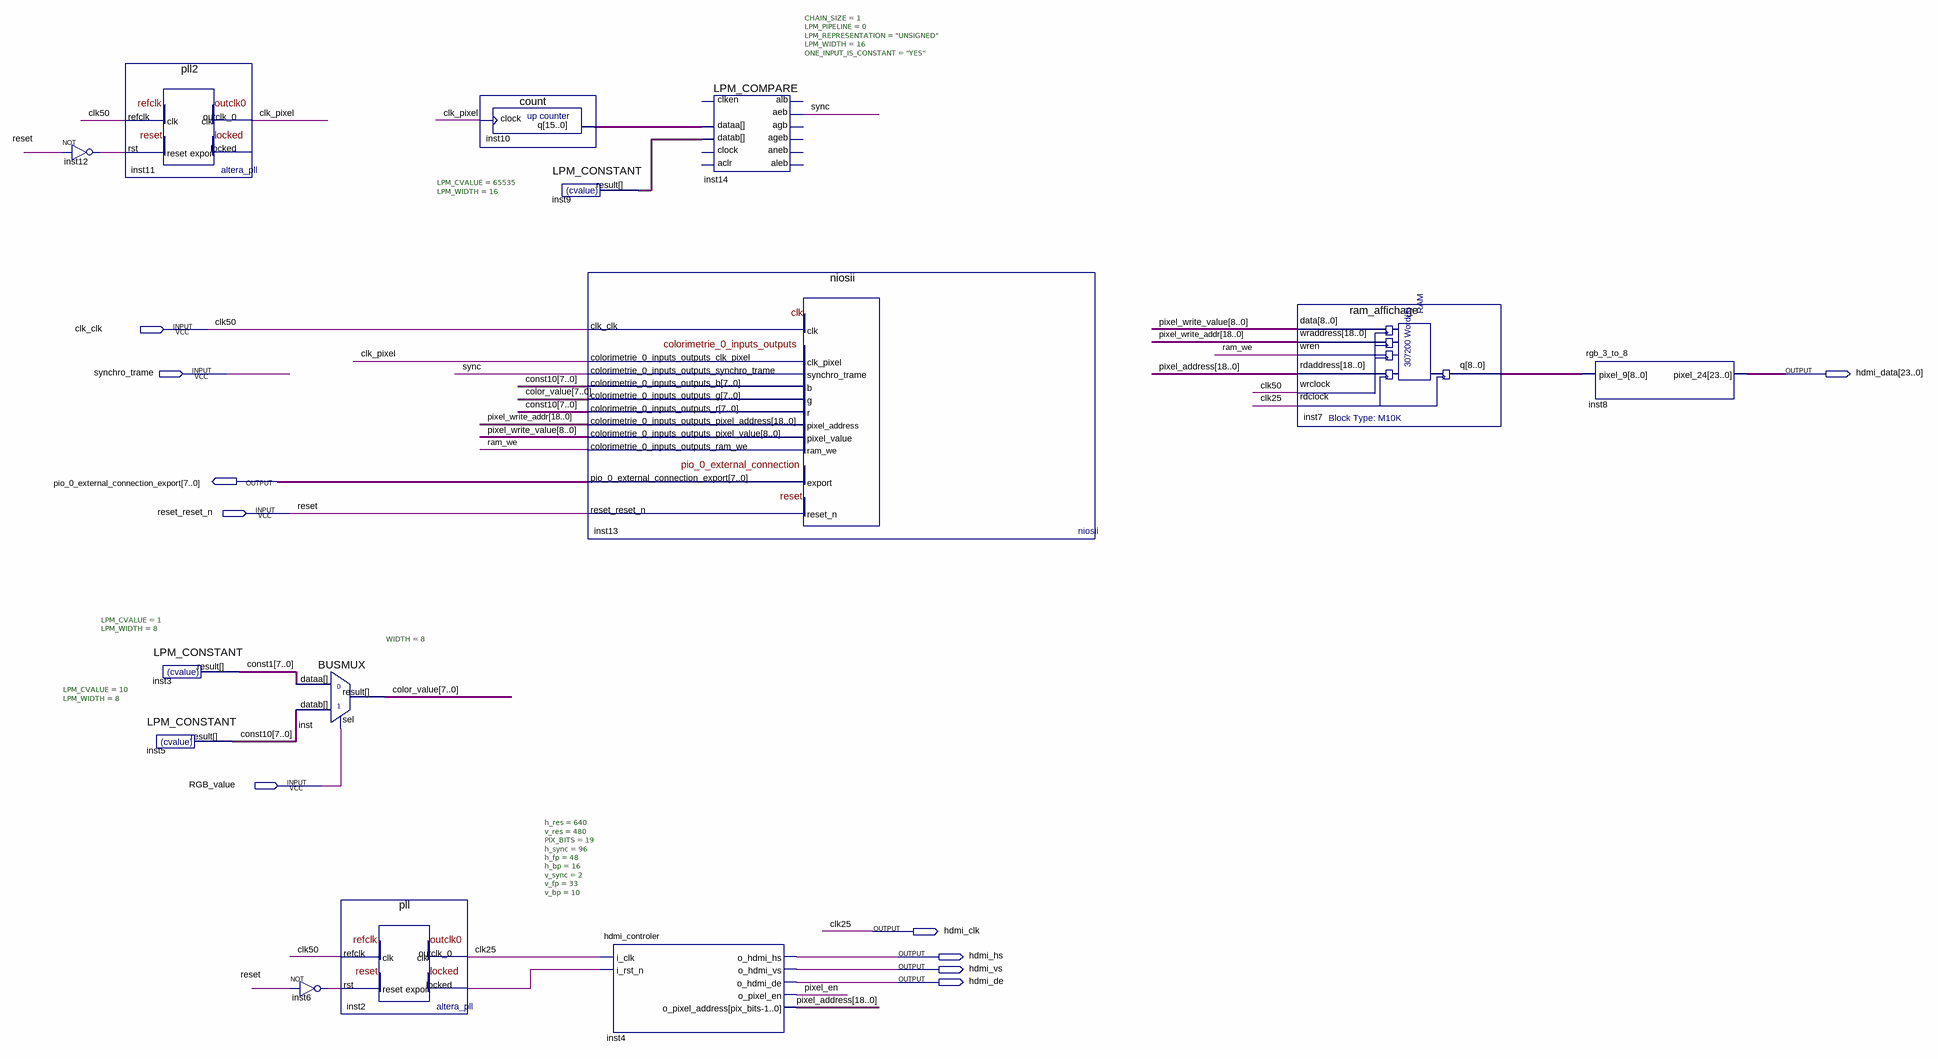
[diagram p0: schematic sheet]
// Quartus schematic videocapsule.bdf as structural Verilog: 14 symbols, 10 pins
module videocapsule (
  input  clk_clk,
  input  synchro_trame,
  input  reset_reset_n,
  input  RGB_value,
  output [23:0] hdmi_data,
  output [7:0] pio_0_external_connection_export,
  output hdmi_clk,
  output hdmi_hs,
  output hdmi_vs,
  output hdmi_de
);

  wire clk_pixel, inst2_locked, inst6_out, inst12_out, pixel_en, ram_we, sync;
  wire [7:0] color_value, const1, const10;
  wire [8:0] inst7_q, pixel_write_value;
  wire [15:0] inst9_result, inst10_q;
  wire [18:0] pixel_address, pixel_write_addr;

  not inst12 (inst12_out, reset_reset_n);
  pll2 inst11 (.refclk(clk_clk), .rst(inst12_out), .outclk_0(clk_pixel));  // open: locked
  LPM_CONSTANT #(.LPM_CVALUE(1), .LPM_WIDTH(8)) inst3 (.result(const1));
  LPM_CONSTANT #(.LPM_CVALUE(10), .LPM_WIDTH(8)) inst5 (.result(const10));
  BUSMUX #(.WIDTH(8)) inst (.datab(const10), .sel(RGB_value), .dataa(const1), .result(color_value));
  not inst6 (inst6_out, reset_reset_n);
  pll inst2 (.refclk(clk_clk), .rst(inst6_out), .outclk_0(hdmi_clk), .locked(inst2_locked));
  count inst10 (.clock(clk_pixel), .q(inst10_q));
  LPM_CONSTANT #(.LPM_CVALUE(65535), .LPM_WIDTH(16)) inst9 (.result(inst9_result));
  niosii inst13 (
    .clk_clk(clk_clk), .colorimetrie_0_inputs_outputs_clk_pixel(clk_pixel),
    .colorimetrie_0_inputs_outputs_synchro_trame(sync), .colorimetrie_0_inputs_outputs_b(const10),
    .colorimetrie_0_inputs_outputs_g(color_value), .colorimetrie_0_inputs_outputs_r(const10),
    .reset_reset_n(reset_reset_n), .colorimetrie_0_inputs_outputs_pixel_address(pixel_write_addr),
    .colorimetrie_0_inputs_outputs_pixel_value(pixel_write_value),
    .colorimetrie_0_inputs_outputs_ram_we(ram_we),
    .pio_0_external_connection_export(pio_0_external_connection_export));
  hdmi_controler #(.h_res(640), .v_res(480), .PIX_BITS(19), .h_sync(96), .h_fp(48), .h_bp(16), .v_sync(2), .v_fp(33), .v_bp(10)) inst4 (
    .i_clk(hdmi_clk), .i_rst_n(inst2_locked), .o_hdmi_hs(hdmi_hs), .o_hdmi_vs(hdmi_vs), .o_hdmi_de(hdmi_de),
    .o_pixel_en(pixel_en), .o_pixel_address(pixel_address));
  LPM_COMPARE #(.CHAIN_SIZE(1), .LPM_PIPELINE(0), .LPM_REPRESENTATION("UNSIGNED"), .LPM_WIDTH(16), .ONE_INPUT_IS_CONSTANT("YES")) inst14 (
    .dataa(inst10_q), .datab(inst9_result), .aeb(sync));  // open: clock, aclr, clken, aleb, agb, aneb, ageb, alb
  ram_affichage inst7 (
    .data(pixel_write_value), .wraddress(pixel_write_addr), .wren(ram_we), .rdaddress(pixel_address),
    .wrclock(clk_clk), .rdclock(hdmi_clk), .q(inst7_q));
  rgb_3_to_8 inst8 (.pixel_9(inst7_q), .pixel_24(hdmi_data));

  // Other names for the same wires on the sheet: clk25 = hdmi_clk; clk50 = clk_clk; reset = reset_reset_n
endmodule
